# Altium schematic sheet nlf15-main.SchDoc
size A4
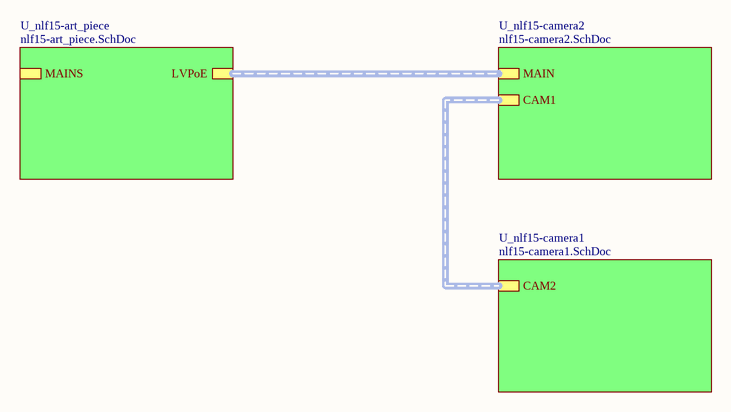
[diagram p0: nlf15-main.SchDoc]

## Sub-sheets
U_nlf15-art_piece = nlf15-art_piece.SchDoc: MAINS (harness MAINS), LVPoE (harness LVPoE-Harness)
U_nlf15-camera1 = nlf15-camera1.SchDoc: CAM2 (harness LVPoE)
U_nlf15-camera2 = nlf15-camera2.SchDoc: CAM1 (harness LVPoE), MAIN (harness LVPoE)

## Buses and harness runs
harness sheet U_nlf15-art_piece/LVPoE = sheet U_nlf15-camera2/MAIN
harness sheet U_nlf15-camera1/CAM2 = sheet U_nlf15-camera2/CAM1